# EAGLE schematic SchemaRobotV1.0 (EAGLE 8.7.0)
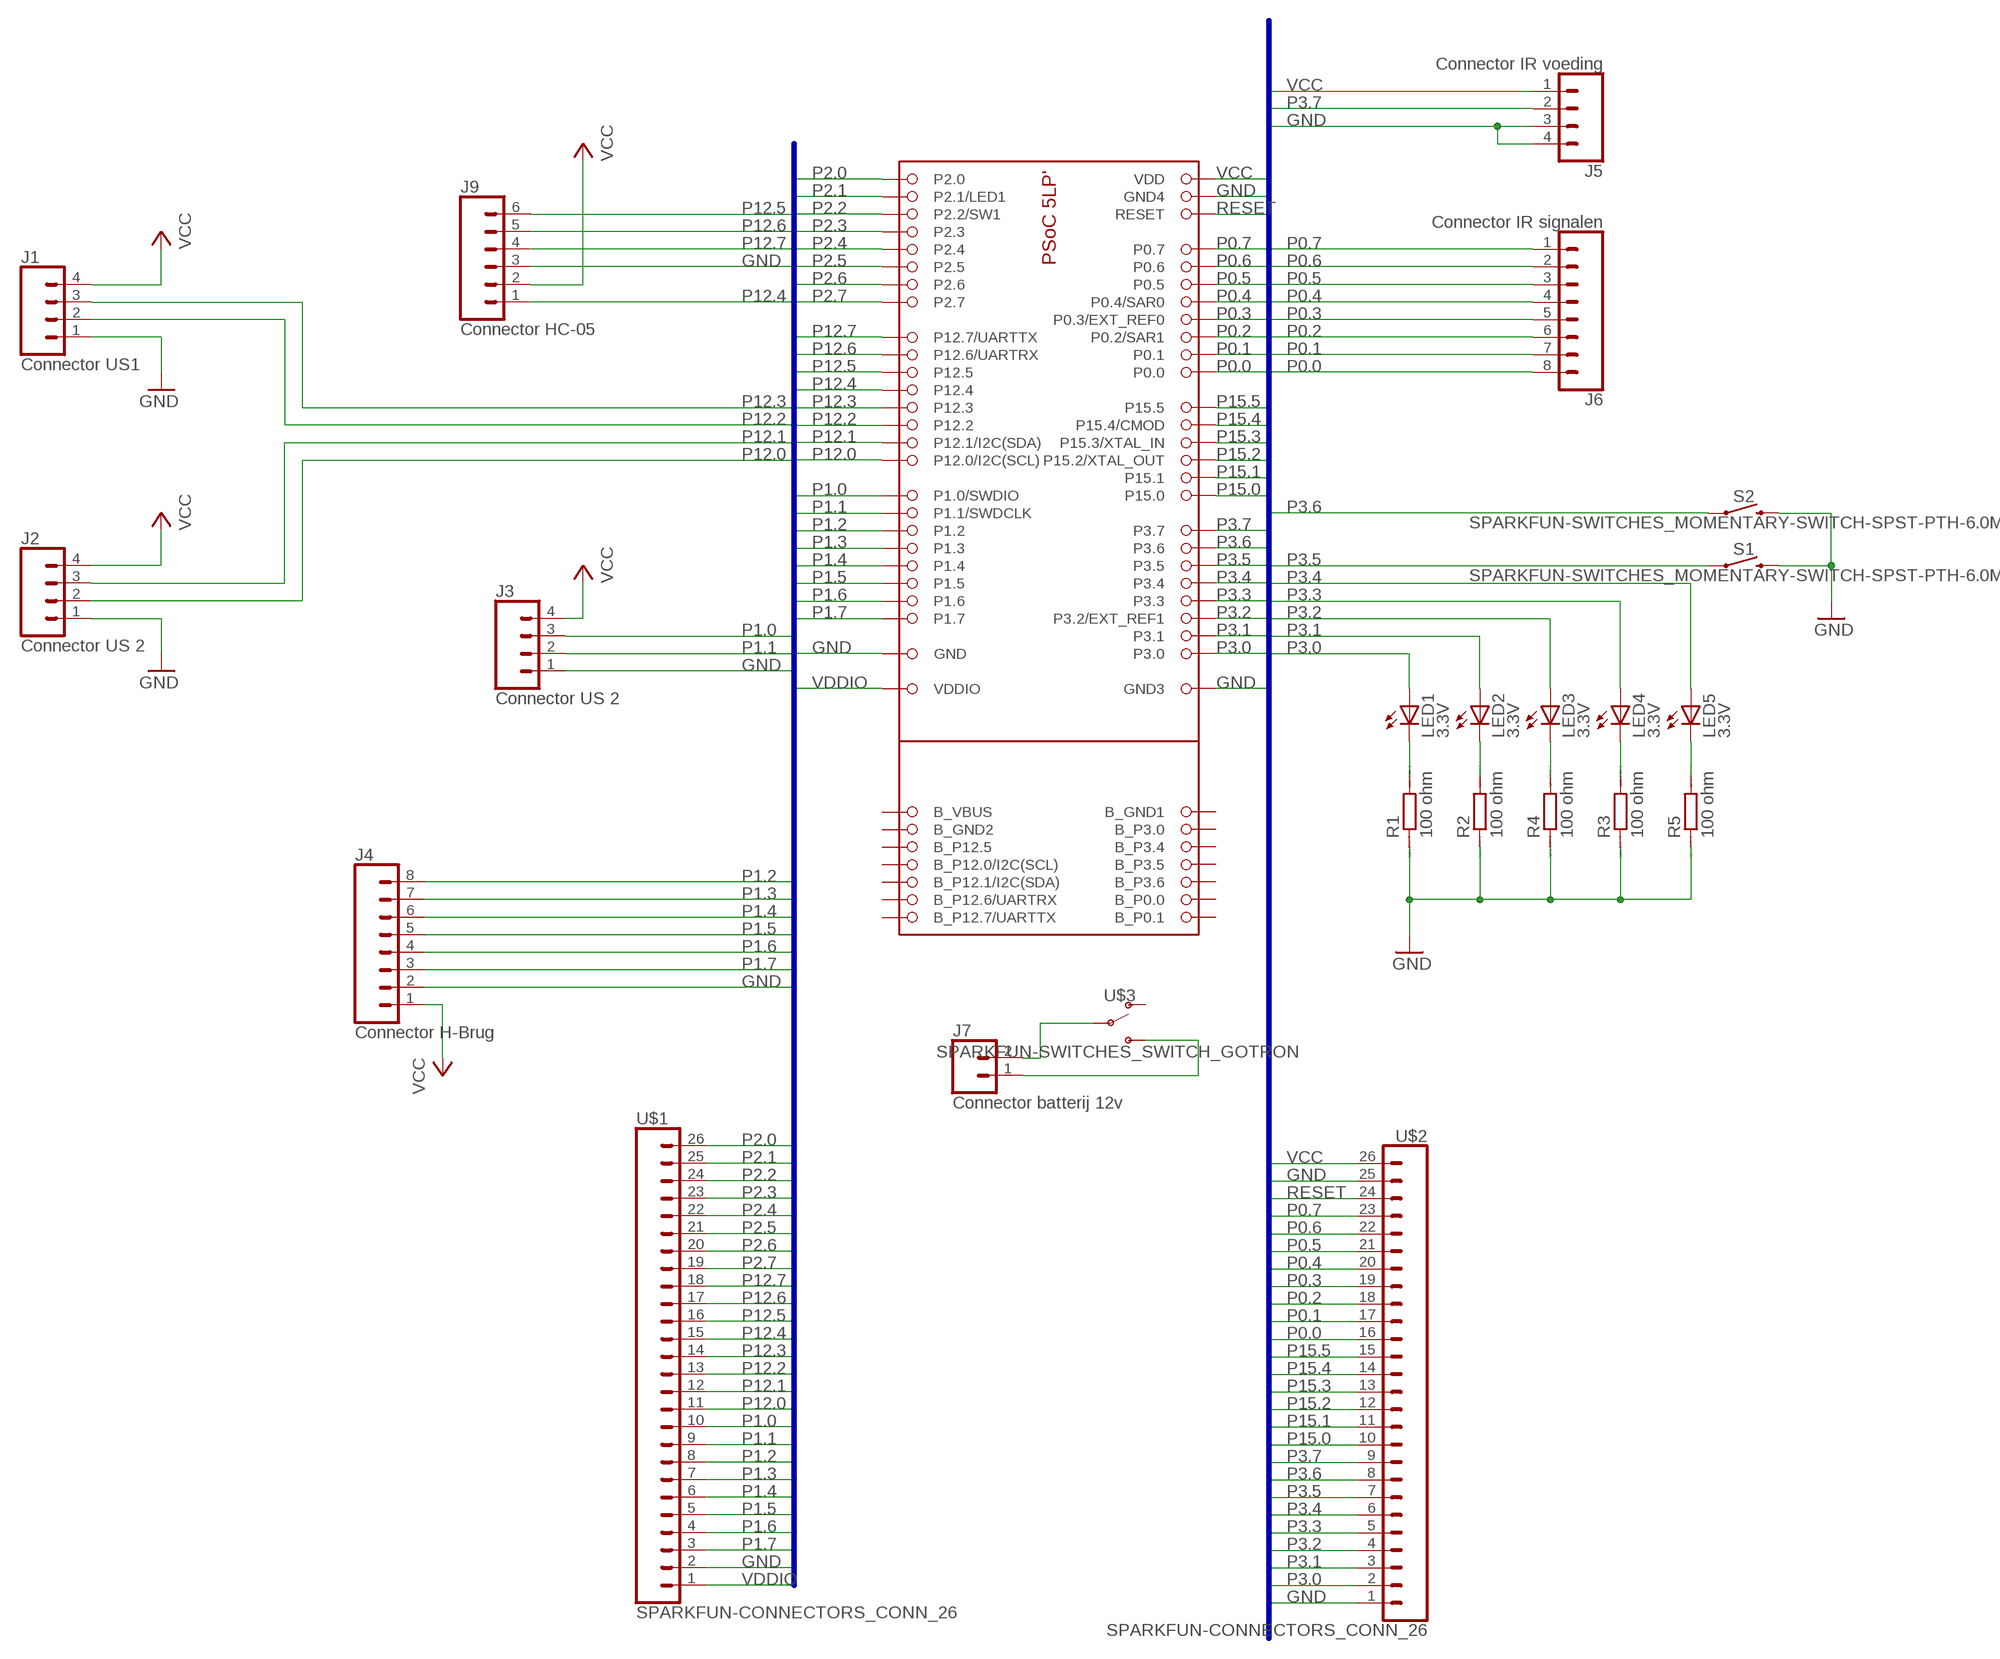
[diagram p0: schematic, sheet 1]

## Parts
DEVICE1  CYPRESSFOOTPRINT_CYPRESS  [CYPRESSFOOTPRINT_CYPRESSFOOTPRINT]
J1  Connector US1  SPARKFUN-CONNECTORS_CONN_04SCREW  [SPARKFUN-CONNECTORS_SCREWTERMINAL-3.5MM-4]
J2  Connector US 2  SPARKFUN-CONNECTORS_CONN_04SCREW  [SPARKFUN-CONNECTORS_SCREWTERMINAL-3.5MM-4]
J3  Connector US 2  SPARKFUN-CONNECTORS_CONN_04SCREW  [SPARKFUN-CONNECTORS_SCREWTERMINAL-3.5MM-4]
J4  Connector H-Brug  SPARKFUN-CONNECTORS_CONN_083.5MM-8  [SPARKFUN-CONNECTORS_SCREWTERMINAL-3.5MM-8]
J5  Connector IR voeding  SPARKFUN-CONNECTORS_CONN_04SCREW  [SPARKFUN-CONNECTORS_SCREWTERMINAL-3.5MM-4]
J6  Connector IR signalen  SPARKFUN-CONNECTORS_CONN_083.5MM-8  [SPARKFUN-CONNECTORS_SCREWTERMINAL-3.5MM-8]
J7  Connector batterij 12v  SPARKFUN-CONNECTORS_CONN_023.5MM  [SPARKFUN-CONNECTORS_SCREWTERMINAL-3.5MM-2]
J9  Connector HC-05  SPARKFUN-CONNECTORS_CONN_06LONGPADS  [SPARKFUN-CONNECTORS_1X06_LONGPADS]
LED1  3.3V  LED_LED5MM  [LED_LED5MM]
LED2  3.3V  LED_LED5MM  [LED_LED5MM]
LED3  3.3V  LED_LED5MM  [LED_LED5MM]
LED4  3.3V  LED_LED5MM  [LED_LED5MM]
LED5  3.3V  LED_LED5MM  [LED_LED5MM]
R1  100 ohm  EAGLE-LTSPICE_R0204/7  [EAGLE-LTSPICE_0204/7]
R2  100 ohm  EAGLE-LTSPICE_R0204/7  [EAGLE-LTSPICE_0204/7]
R3  100 ohm  EAGLE-LTSPICE_R0204/7  [EAGLE-LTSPICE_0204/7]
R4  100 ohm  EAGLE-LTSPICE_R0204/7  [EAGLE-LTSPICE_0204/7]
R5  100 ohm  EAGLE-LTSPICE_R0204/7  [EAGLE-LTSPICE_0204/7]
S1  SPARKFUN-SWITCHES_MOMENTARY-SWITCH-SPST-PTH-6.0MM  [SPARKFUN-SWITCHES_TACTILE_SWITCH_PTH_6.0MM]
S2  SPARKFUN-SWITCHES_MOMENTARY-SWITCH-SPST-PTH-6.0MM  [SPARKFUN-SWITCHES_TACTILE_SWITCH_PTH_6.0MM]
U$1  SPARKFUN-CONNECTORS_CONN_26  [SPARKFUN-CONNECTORS_1X26]
U$2  SPARKFUN-CONNECTORS_CONN_26  [SPARKFUN-CONNECTORS_1X26]
U$3  SPARKFUN-SWITCHES_SWITCH_GOTRON  [SPARKFUN-SWITCHES_SWITCH_SPDT_PTH_11.6X5.60MM]

## Nets
GND [Ground]: DEVICE1.GND DEVICE1.GND3 DEVICE1.GND4 J1.1 J2.1 J3.1 J4.2 J5.3 J5.4 J9.3 R1.1 R2.1 R3.1 R4.1 R5.1 S1.3 S2.3 U$1.2 U$2.1 U$2.25
N$1: J7.2 U$3.2(P)
N$2: LED1.K(C) R1.2
N$3: LED2.K(C) R2.2
N$4: LED3.K(C) R4.2
N$5: LED4.K(C) R3.2
N$6: LED5.K(C) R5.2
N$7: J7.1 U$3.3(S)
P0.0: DEVICE1.P0.0 J6.8 U$2.16
P0.1: DEVICE1.P0.1 J6.7 U$2.17
P0.2: DEVICE1.P0.2/SAR1 J6.6 U$2.18
P0.3: DEVICE1.P0.3/EXT_REF0 J6.5 U$2.19
P0.4: DEVICE1.P0.4/SAR0 J6.4 U$2.20
P0.5: DEVICE1.P0.5 J6.3 U$2.21
P0.6: DEVICE1.P0.6 J6.2 U$2.22
P0.7: DEVICE1.P0.7 J6.1 U$2.23
P1.0: DEVICE1.P1.0/SWDIO J3.3 U$1.10
P1.1: DEVICE1.P1.1/SWDCLK J3.2 U$1.9
P1.2: DEVICE1.P1.2 J4.8 U$1.8
P1.3: DEVICE1.P1.3 J4.7 U$1.7
P1.4: DEVICE1.P1.4 J4.6 U$1.6
P1.5: DEVICE1.P1.5 J4.5 U$1.5
P1.6: DEVICE1.P1.6 J4.4 U$1.4
P1.7: DEVICE1.P1.7 J4.3 U$1.3
P2.0: DEVICE1.P2.0 U$1.26
P2.1: DEVICE1.P2.1/LED1 U$1.25
P2.2: DEVICE1.P2.2/SW1 U$1.24
P2.3: DEVICE1.P2.3 U$1.23
P2.4: DEVICE1.P2.4 U$1.22
P2.5: DEVICE1.P2.5 U$1.21
P2.6: DEVICE1.P2.6 U$1.20
P2.7: DEVICE1.P2.7 U$1.19
P3.0: DEVICE1.P3.0 LED1.A U$2.2
P3.1: DEVICE1.P3.1 LED2.A U$2.3
P3.2: DEVICE1.P3.2(P3.2/EXT_REF1) LED3.A U$2.4
P3.3: DEVICE1.P3.3 LED4.A U$2.5
P3.4: DEVICE1.P3.4 LED5.A U$2.6
P3.5: DEVICE1.P3.5 S1.1 U$2.7
P3.6: DEVICE1.P3.6 S2.1 U$2.8
P3.7: DEVICE1.P3.7 J5.2 U$2.9
P12.0: DEVICE1.P12.0/I2C(SCL) J2.2 U$1.11
P12.1: DEVICE1.P12.1/I2C(SDA) J2.3 U$1.12
P12.2: DEVICE1.P12.2 J1.2 U$1.13
P12.3: DEVICE1.P12.3 J1.3 U$1.14
P12.4: DEVICE1.P12.4 J9.1 U$1.15
P12.5: DEVICE1.P12.5 J9.6 U$1.16
P12.6: DEVICE1.P12.6/UARTRX J9.5 U$1.17
P12.7: DEVICE1.P12.7/UARTTX J9.4 U$1.18
P15.0: DEVICE1.P15.0 U$2.10
P15.1: DEVICE1.P15.1 U$2.11
P15.2: DEVICE1.P15.2/XTAL_OUT U$2.12
P15.3: DEVICE1.P15.3/XTAL_IN U$2.13
P15.4: DEVICE1.P15.4/CMOD U$2.14
P15.5: DEVICE1.P15.5 U$2.15
RESET: DEVICE1.RESET U$2.24
VCC: DEVICE1.VVD(VDD) J1.4 J2.4 J3.4 J4.1 J5.1 J9.2 U$2.26
VDDIO: DEVICE1.VDDIO U$1.1
Unconnected: DEVICE1.B_12.0/I2C(SCL)(B_P12.0/I2C(SCL)) DEVICE1.B_12.1/I2C(SDA)(B_P12.1/I2C(SDA)) DEVICE1.B_12.6/UARTRX(B_P12.6/UARTRX) DEVICE1.B_12.7/UARTTX(B_P12.7/UARTTX) DEVICE1.B_GND1 DEVICE1.B_GND2 DEVICE1.B_P0.0 DEVICE1.B_P0.1 DEVICE1.B_P3.0 DEVICE1.B_P3.4 DEVICE1.B_P3.5 DEVICE1.B_P3.6 DEVICE1.B_P12.5 DEVICE1.B_VBUS U$3.1(O)

## Buses
P2.0,P2.1,P2.2,P2.3,P2.4,P2.5,P2.6,P2.7,P12.7,P12.6,P12.5,P12.4,P12.3,P12.2,P12.1,P12.0,P1.0,P1.1,P1.2,P1.3,P1.4,P1.5,P1.6,P1.7,GND,VDDIO
VCC,GND,RESET,P0.7,P0.6,P0.5,P0.4,P0.3,P0.2,P0.1,P0.0,P15.5,P15.4,P15.3,P15.2,P15.1,P15.0,P3.7,P3.6,P3.5,P3.4,P3.3,P3.2,P3.1,P3.0

## Library data of the parts
DEVICE1 = Board_1_23:CYPRESSFOOTPRINT_CYPRESS
J1-J3 J5 = SchemaRobotV1.0:SPARKFUN-CONNECTORS_CONN_04: Multi connection point. Often used as Generic Header-pin footprint for 0.1 inch spaced/style header connections On any of the 0.1 inch spaced packages, you can populate with these: Break Away Headers - Straight <https://www.sparkfun.com/products/116> (PRT-00116) Break Away Male Headers - Right Angle <https://www.sparkfun.com/products/553> (PRT-00553) Female Headers <https://www.sparkfun.com/products/115> (PRT-00115) Break Away Headers - Machine Pin <https://www.sparkfun.com/products/117> (PRT-00117) Break Away Female Headers - Swiss Machine Pin <https://www.sparkfun.com/products/743> (PRT-00743) For SCREWTERMINALS and SPRING TERMINALS visit here: Screw Terimnals on SparkFun.com <https://www.sparkfun.com/search/results?term=Screw+Terminals> (5mm/3.5mm/2.54mm spacing) This device is also useful as a general connection point to wire up your design to another part of your project. Our various solder wires solder well into these plated through hole pads. Hook-Up Wire - Assortment (Stranded, 22 AWG) <https://www.sparkfun.com/products/11375> (PRT-11375) Hook-Up Wire - Assortment (Solid Core, 22 AWG) <https://www.sparkfun.com/products/11367> (PRT-11367) View the entire wire category on our website here <https://www.sparkfun.com/categories/141> Special notes: Molex polarized connector foot print use with SKU : PRT-08231 with associated crimp pins and housings. 1MM SMD Version SKU: PRT-10208; PROD_ID: 2xCONN-08399; SF_ID: 2xPRT-08084
J4 J6 = SchemaRobotV1.0:SPARKFUN-CONNECTORS_CONN_08: Multi connection point. Often used as Generic Header-pin footprint for 0.1 inch spaced/style header connections On any of the 0.1 inch spaced packages, you can populate with these: Break Away Headers - Straight <https://www.sparkfun.com/products/116> (PRT-00116) Break Away Male Headers - Right Angle <https://www.sparkfun.com/products/553> (PRT-00553) Female Headers <https://www.sparkfun.com/products/115> (PRT-00115) Break Away Headers - Machine Pin <https://www.sparkfun.com/products/117> (PRT-00117) Break Away Female Headers - Swiss Machine Pin <https://www.sparkfun.com/products/743> (PRT-00743) Arduino Stackable Header - 8 Pin <https://www.sparkfun.com/products/9279> (PRT-09279) For SCREWTERMINALS and SPRING TERMINALS visit here: Screw Terimnals on SparkFun.com <https://www.sparkfun.com/search/results?term=Screw+Terminals> (5mm/3.5mm/2.54mm spacing) This device is also useful as a general connection point to wire up your design to another part of your project. Our various solder wires solder well into these plated through hole pads. Hook-Up Wire - Assortment (Stranded, 22 AWG) <https://www.sparkfun.com/products/11375> (PRT-11375) Hook-Up Wire - Assortment (Solid Core, 22 AWG) <https://www.sparkfun.com/products/11367> (PRT-11367) View the entire wire category on our website here <https://www.sparkfun.com/categories/141> Special notes: Molex polarized connector foot print use with SKU : PRT-08231 with associated crimp pins and housings. 1MM SMD Version SKU: PRT-10208 NOTES ON THE VARIANTS LOCK and LOCK_LONGPADS... This footprint was designed to help hold the alignment of a through-hole component (i.e. 6-pin header) while soldering it into place. You may notice that each hole has been shifted either up or down by 0.005 of an inch from it's more standard position (which is a perfectly straight line). This slight alteration caused the pins (the squares in the middle) to touch the edges of the holes. Because they are alternating, it causes a "brace" to hold the component in place. 0.005 has proven to be the perfect amount of "off-center" position when using our standard breakaway headers. Although looks a little odd when you look at the bare footprint, once you have a header in there, the alteration is very hard to notice. Also,if you push a header all the way into place, it is covered up entirely on the bottom side.
J7 = SchemaRobotV1.0:SPARKFUN-CONNECTORS_CONN_02: Multi connection point. Often used as Generic Header-pin footprint for 0.1 inch spaced/style header connections On any of the 0.1 inch spaced packages, you can populate with these: Break Away Headers - Straight <https://www.sparkfun.com/products/116> (PRT-00116) Break Away Male Headers - Right Angle <https://www.sparkfun.com/products/553> (PRT-00553) Female Headers <https://www.sparkfun.com/products/115> (PRT-00115) Break Away Headers - Machine Pin <https://www.sparkfun.com/products/117> (PRT-00117) Break Away Female Headers - Swiss Machine Pin <https://www.sparkfun.com/products/743> (PRT-00743) For SCREWTERMINALS and SPRING TERMINALS visit here: Screw Terimnals on SparkFun.com <https://www.sparkfun.com/search/results?term=Screw+Terminals> (5mm/3.5mm/2.54mm spacing) This device is also useful as a general connection point to wire up your design to another part of your project. Our various solder wires solder well into these plated through hole pads. Hook-Up Wire - Assortment (Stranded, 22 AWG) <https://www.sparkfun.com/products/11375> (PRT-11375) Hook-Up Wire - Assortment (Solid Core, 22 AWG) <https://www.sparkfun.com/products/11367> (PRT-11367) View the entire wire category on our website here <https://www.sparkfun.com/categories/141> Special notes: Molex polarized connector foot print use with: PRT-08233 with associated crimp pins and housings. 2.54_SCREWTERM for use with PRT-10571. 3.5mm Screw Terminal footprints for PRT-08084 5mm Screw Terminal footprints for use with PRT-08432; PROD_ID: CONN-08399
J9 = SchemaRobotV1.0:SPARKFUN-CONNECTORS_CONN_06: Multi connection point. Often used as Generic Header-pin footprint for 0.1 inch spaced/style header connections On any of the 0.1 inch spaced packages, you can populate with these: Break Away Headers - Straight <https://www.sparkfun.com/products/116> (PRT-00116) Break Away Male Headers - Right Angle <https://www.sparkfun.com/products/553> (PRT-00553) Female Headers <https://www.sparkfun.com/products/115> (PRT-00115) Break Away Headers - Machine Pin <https://www.sparkfun.com/products/117> (PRT-00117) Break Away Female Headers - Swiss Machine Pin <https://www.sparkfun.com/products/743> (PRT-00743) Arduino Stackable Header - 6 Pin <https://www.sparkfun.com/products/9280> (PRT-09280) For SCREWTERMINALS and SPRING TERMINALS visit here: Screw Terimnals on SparkFun.com <https://www.sparkfun.com/search/results?term=Screw+Terminals> (5mm/3.5mm/2.54mm spacing) This device is also useful as a general connection point to wire up your design to another part of your project. Our various solder wires solder well into these plated through hole pads. Hook-Up Wire - Assortment (Stranded, 22 AWG) <https://www.sparkfun.com/products/11375> (PRT-11375) Hook-Up Wire - Assortment (Solid Core, 22 AWG) <https://www.sparkfun.com/products/11367> (PRT-11367) View the entire wire category on our website here <https://www.sparkfun.com/categories/141>
LED1-LED5 = SchemaRobotV1.0:LED_LED: LED OSRAM: - CHIPLED LG R971, LG N971, LY N971, LG Q971, LY Q971, LO R971, LY R971 LH N974, LH R974 LS Q976, LO Q976, LY Q976 LO Q996 - Hyper CHIPLED LW Q18S LB Q993, LB Q99A, LB R99A - SideLED LS A670, LO A670, LY A670, LG A670, LP A670 LB A673, LV A673, LT A673, LW A673 LH A674 LY A675 LS A676, LA A676, LO A676, LY A676, LW A676 LS A679, LY A679, LG A679 - Hyper Micro SIDELED® LS Y876, LA Y876, LO Y876, LY Y876 LT Y87S - SmartLED LW L88C, LW L88S LB L89C, LB L89S, LG L890 LS L89K, LO L89K, LY L89K LS L896, LA L896, LO L896, LY L896 - TOPLED LS T670, LO T670, LY T670, LG T670, LP T670 LSG T670, LSP T670, LSY T670, LOP T670, LYG T670 LG T671, LOG T671, LSG T671 LB T673, LV T673, LT T673, LW T673 LH T674 LS T676, LA T676, LO T676, LY T676, LB T676, LH T676, LSB T676, LW T676 LB T67C, LV T67C, LT T67C, LS T67K, LO T67K, LY T67K, LW E67C LS E67B, LA E67B, LO E67B, LY E67B, LB E67C, LV E67C, LT E67C LW T67C LS T679, LY T679, LG T679 LS T770, LO T770, LY T770, LG T770, LP T770 LB T773, LV T773, LT T773, LW T773 LH T774 LS E675, LA E675, LY E675, LS T675 LS T776, LA T776, LO T776, LY T776, LB T776 LHGB T686 LT T68C, LB T68C - Hyper Mini TOPLED® LB M676 - Mini TOPLED Santana® LG M470 LS M47K, LO M47K, LY M47K Source: http://www.osram.convergy.de LUXEON: - LUMILED® LXK2-PW12-R00, LXK2-PW12-S00, LXK2-PW14-U00, LXK2-PW14-V00 LXK2-PM12-R00, LXK2-PM12-S00, LXK2-PM14-U00 LXK2-PE12-Q00, LXK2-PE12-R00, LXK2-PE12-S00, LXK2-PE14-T00, LXK2-PE14-U00 LXK2-PB12-K00, LXK2-PB12-L00, LXK2-PB12-M00, LXK2-PB14-N00, LXK2-PB14-P00, LXK2-PB14-Q00 LXK2-PR12-L00, LXK2-PR12-M00, LXK2-PR14-Q00, LXK2-PR14-R00 LXK2-PD12-Q00, LXK2-PD12-R00, LXK2-PD12-S00 LXK2-PH12-R00, LXK2-PH12-S00 LXK2-PL12-P00, LXK2-PL12-Q00, LXK2-PL12-R00 Source: www.luxeon.com KINGBRIGHT: KA-3528ASYC Source: www.kingbright.com
R1-R5 = SchemaRobotV1.0:EAGLE-LTSPICE_R: RESISTOR, European symbol; SPICEMODEL: NONE; SPICEPREFIX: R
S1 S2 = SchemaRobotV1.0:SPARKFUN-SWITCHES_MOMENTARY-SWITCH-SPST: Momentary Switch (Pushbutton) - SPST Normally-open (NO) SPST momentary switches (buttons, pushbuttons). Variants PTH-12MM - 12mm square, through-hole Momentary Pushbutton Switch - 12mm Square <https://www.sparkfun.com/products/9190> (COM-09190) PTH-6.0MM, PTH-6.0MM-KIT - 6.0mm square, through-hole Mini Pushbutton Switch <https://www.sparkfun.com/products/97> (COM-00097) KIT package intended for soldering kit's - only one side of pads' copper is exposed. PTH-RIGHT-ANGLE-KIT - Right-angle, through-hole Right Angle Tactile Button <https://www.sparkfun.com/products/10791> - Used on SparkFun BigTime Watch Kit <https://www.sparkfun.com/products/11734> SMD-12MM - 12mm square, surface-mount Tactile Button - SMD (12mm) <https://www.sparkfun.com/products/12993> (COM-12993) Used on SparkFun PicoBoard <https://www.sparkfun.com/products/11888> SMD-4.5MM - 4.5mm Square Trackball Switch Used on SparkFun Blackberry Trackballer Breakout <https://www.sparkfun.com/products/13169> SMD-4.6MMX2.8MM - 4.60mm x 2.80mm, surface mount Used on SparkFun SAMD21 Mini Breakout <https://www.sparkfun.com/products/13664> SMD-5.2MM, SMD-5.2-REDUNDANT - 5.2mm square, surface-mount Mini Pushbutton Switch - SMD <https://www.sparkfun.com/products/8720> (COM-08720) Used on Arduino Pro Mini <https://www.sparkfun.com/products/11114> REDUNDANT package connects both switch circuits together SMD-6.0X3.5MM - 6.0 x 3.5mm, surface mount Momentary Reset Switch SMD <https://www.sparkfun.com/products/8229> (COM-08229) SMD-6.2MM-TALL - 6.2mm square, surface mount Tactile Button - SMD (6mm) <https://www.sparkfun.com/products/12992> Used on SparkFun Digital Sandbox <https://www.sparkfun.com/products/12651> SMD-RIGHT-ANGLE - Right-angle, surface mount Used on SparkFun Block for Intel® Edison - Arduino <https://www.sparkfun.com/products/13036>; PROD_ID: SWCH-08441; SF_SKU: COM-00097
U$1 U$2 = SchemaRobotV1.0:SPARKFUN-CONNECTORS_CONN_26
U$3 = SchemaRobotV1.0:SPARKFUN-SWITCHES_SWITCH_GOTRON

## Net classes
0 default: width 0.406 mm
1 Ground: width 0.61 mm
2 fromBat: width 0.61 mm
3 toBat: width 0.61 mm